# Altium schematic sheet PowerV2.SchDoc
size A3; SheetNumber: 5; SheetTotal: 6
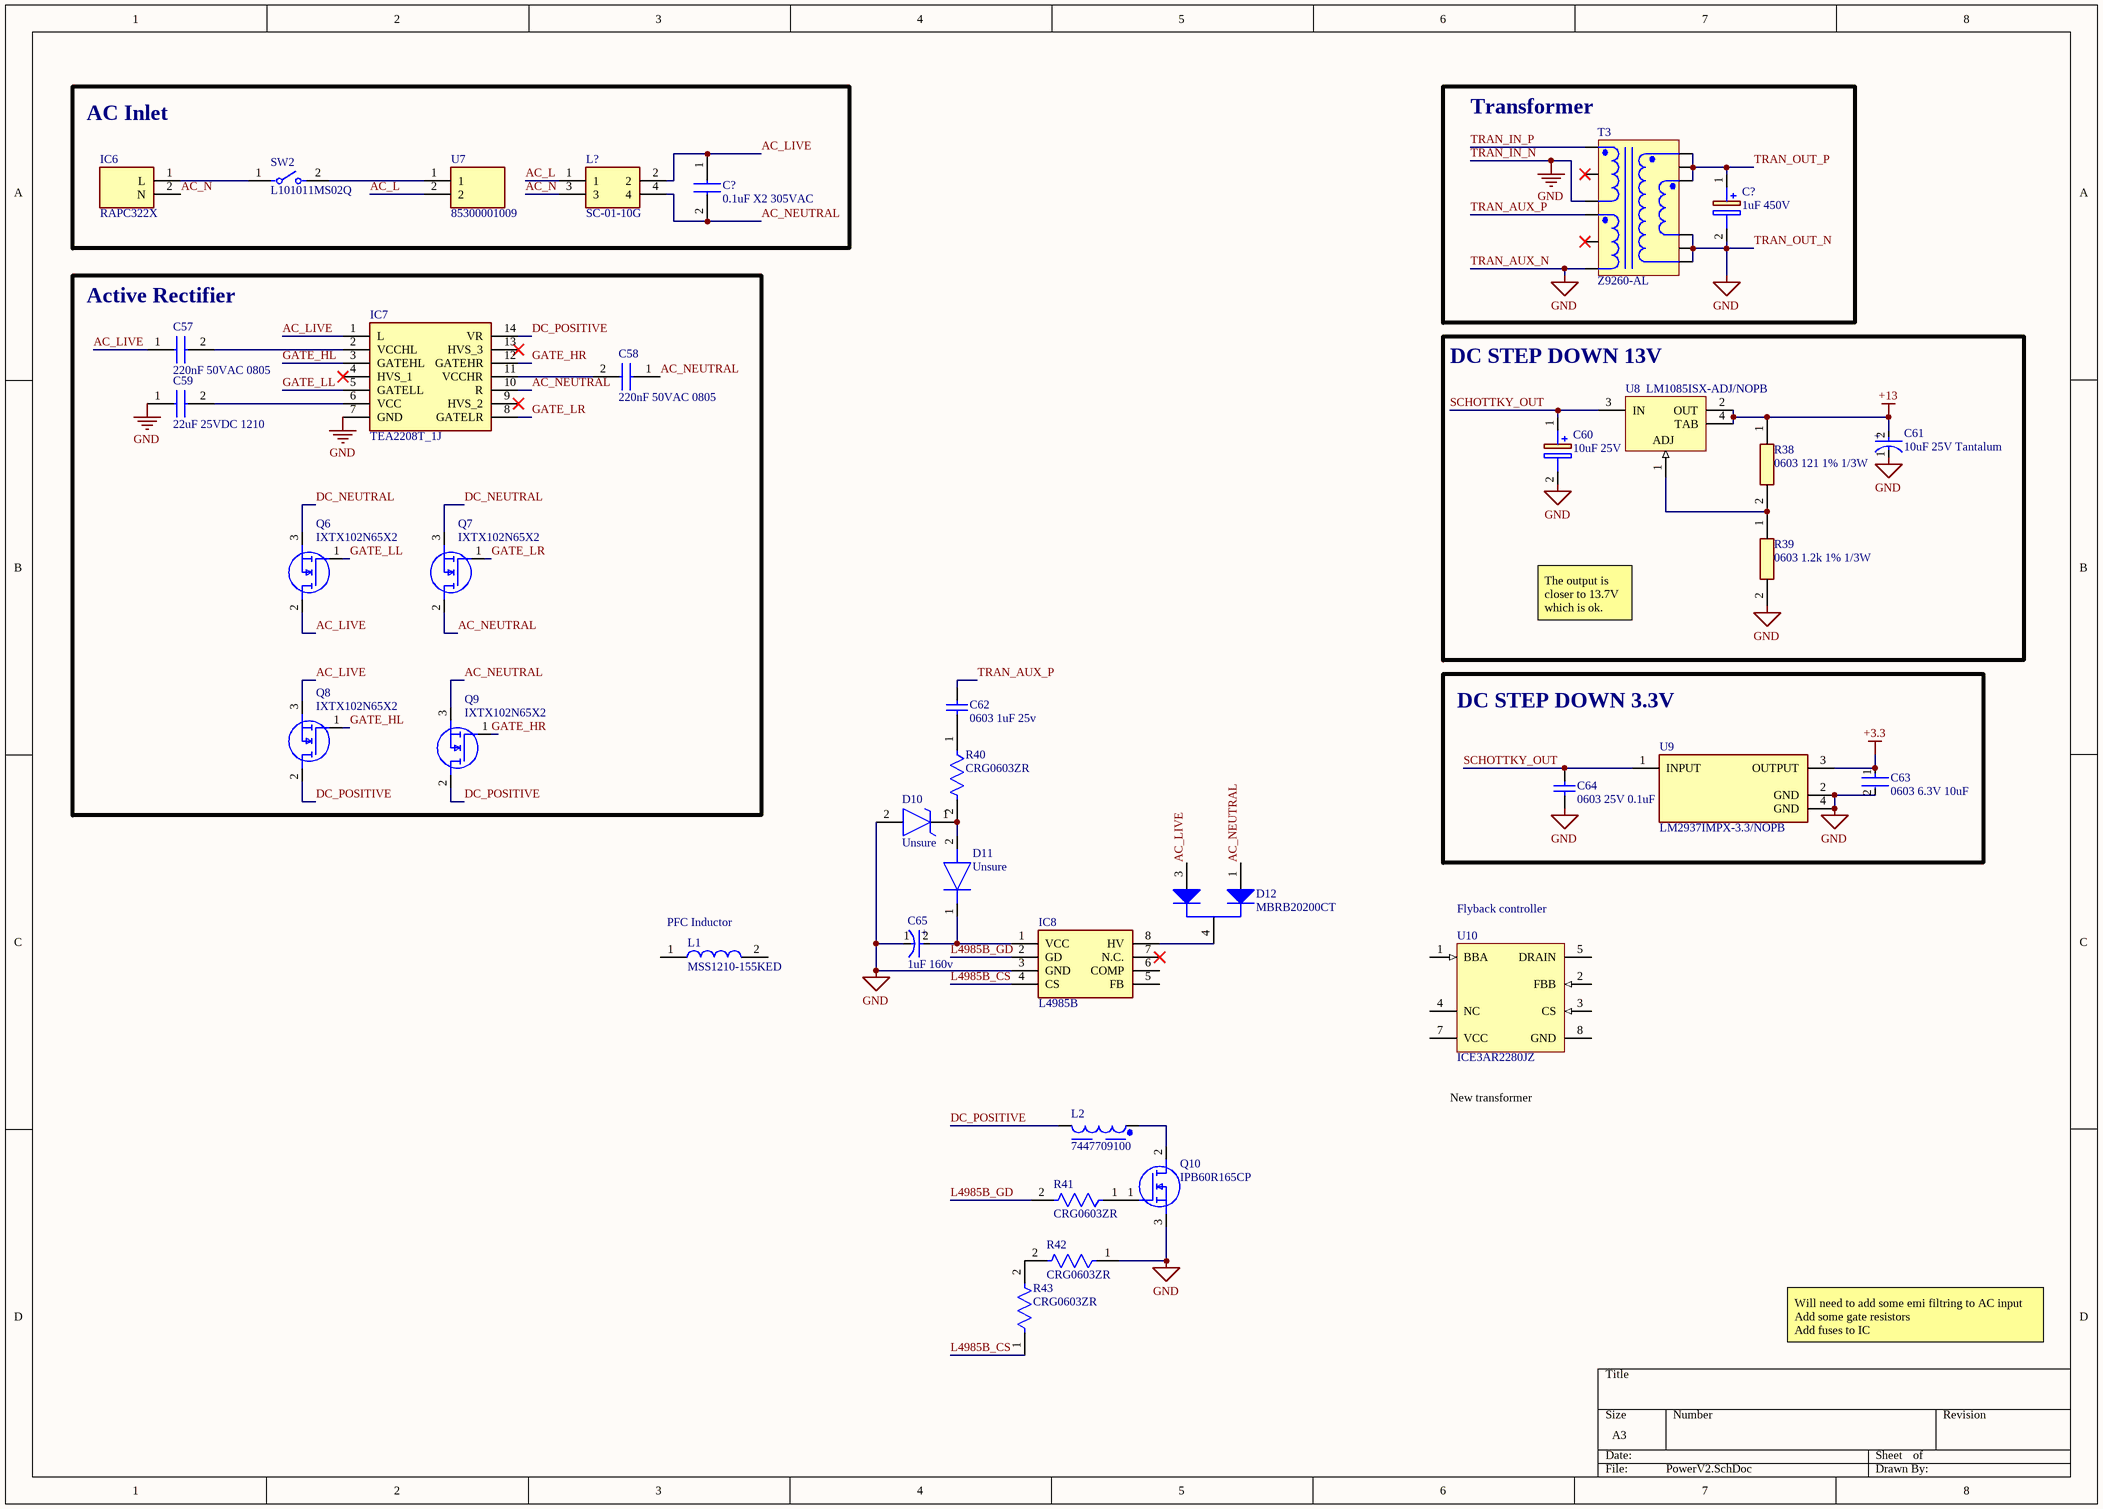
[diagram p0: PowerV2.SchDoc]

## Parts
(Parts that share a designator on the sheet are numbered #1, #2 ... from top to bottom, then left to right.)
C57  220nF 50VAC 0805  [CAPC2012X145N]
C58  220nF 50VAC 0805  [CAPC2012X145N]
C59  22uF 25VDC 1210  [CAPC3225X200N]
C60  10uF 25V  [CAPPRD200W55D500H1200]
C61  10uF 25V Tantalum  [FP-TAJB-MFG]
C62  0603 1uF 25v  [CAPC1608X87X35LL15T15]
C63  0603 6.3V 10uF  [FP-GRM188-0_1-e0_2_0_55-IPC_A]
C64  0603 25V 0.1uF  [CAPC1608X87X35LL15T15]
C65  1uF 160v  [FP-ECA-2CHG010I-MFG]
C?#1  0.1uF X2 305VAC  [B32922C_(18_x_5)]
C?#2  1uF 450V  [CAPPRD350W65D825H1250]
D10  Unsure  [DIOM5336X244N]
D11  Unsure  [DIOM5226X262N]
D12  MBRB20200CT  [ONSC-D2PAK-3-418B-04_V]
IC6  RAPC322X  [RAPC322X]
IC7  TEA2208T_1J  [SOIC127P600X175-14N]
IC8  L4985B  [SOIC127P600X175-8N]
L1  MSS1210-155KED  [MSS1210155KED]
L2  7447709100  [WE-PD_1210]
L?  SC-01-10G  [SC0110G]
Q6  IXTX102N65X2  [TO546P531X1980X2918-3P]
Q7  IXTX102N65X2  [TO546P531X1980X2918-3P]
Q8  IXTX102N65X2  [TO546P531X1980X2918-3P]
Q9  IXTX102N65X2  [TO546P531X1980X2918-3P]
Q10  IPB60R165CP  [IPB60R165CP]
R38  0603 121 1% 1/3W  [RESC1608X55N]
R39  0603 1.2k 1% 1/3W  [RESC1608X55N]
R40  CRG0603ZR  [FP-CRG0603-IPC_C]
R41  CRG0603ZR  [FP-CRG0603-IPC_C]
R42  CRG0603ZR  [FP-CRG0603-IPC_C]
R43  CRG0603ZR  [FP-CRG0603-IPC_C]
SW2  L101011MS02Q  [FP-L101011MS02Q-MFG]
T3  Z9260-AL  [COIL-Z9260-AL_Z9007-BL-12_V]
U7  85300001009  [85300001009]
U8  LM1085ISX-ADJ/NOPB  [KTT0003B_M]
U9  LM2937IMPX-3.3/NOPB  [FP-DCY0004A-IPC_A]
U10  ICE3AR2280JZ  [INF-PG-DIP-7-1_A]

## Blocks framed on the sheet
AC Inlet: C?#1 IC6 L? SW2 U7
Transformer: C?#2 T3
Active Rectifier: C57-C59 IC7 Q6-Q9
DC STEP DOWN 13V: C60 C61 R38 R39 U8
DC STEP DOWN 3.3V: C63 C64 U9

## Nets
+3.3: C63.1 U9.3(OUTPUT)
+13: C61.2(A) R38.1 U8.2(OUT) U8.4(TAB)
TRAN_AUX_N: C59.1 C60.2(-) C61.1(C) C63.2 C64.2 C65.1(C) C?#2.2(-) D10.2(A) IC7.7(GND) IC8.3(GND) Q10.3(S) R39.2 R42.1 T3.1 T3.2 T3.3 T3.7 T3.8 U9.2(GND) U9.4(GND)  [also labelled GND, TRAN_IN_N, TRAN_OUT_N]
AC_L: L?.1 U7.2
AC_LIVE: C57.1 C?#1.1 D12.3(A2) IC7.1(L) L?.2 Q6.2(D) Q8.3(S)
AC_N: IC6.2(N) L?.3
AC_NEUTRAL: C58.1 C?#1.2 D12.1(A1) IC7.10(R) L?.4 Q7.2(D) Q9.3(S)
DC_NEUTRAL: Q6.3(S) Q7.3(S)
DC_POSITIVE: IC7.14(VR) L2.2 Q8.2(D) Q9.2(D)
GATE_HL: IC7.3(GATEHL) Q8.1(G)
GATE_HR: IC7.12(GATEHR) Q9.1(G)
GATE_LL: IC7.5(GATELL) Q6.1(G)
GATE_LR: IC7.8(GATELR) Q7.1(G)
L4985B_CS: IC8.4(CS) R43.1
L4985B_GD: IC8.2(GD) R41.2
SCHOTTKY_OUT: C60.1(+) C64.1 U8.3(IN) U9.1(INPUT)
TRAN_AUX_P: C62.2 T3.11
TRAN_IN_P: T3.12
TRAN_OUT_P: C?#2.1(+) T3.4 T3.5 T3.6
NetC57_2: C57.2 IC7.2(VCCHL)
NetC58_2: C58.2 IC7.11(VCCHR)
NetC59_2: C59.2 IC7.6(VCC)
NetC62_1: C62.1 R40.1
NetC65_2: C65.2(A) D11.1(K) IC8.1(VCC)
NetD10_1: D10.1(K) D11.2(A) R40.2
NetD12_4: D12.4(K) IC8.8(HV)
NetIC6_1: IC6.1(L) SW2.1
NetL2_1: L2.1 Q10.2(D)
NetQ10_1: Q10.1(G) R41.1
NetR38_2: R38.2 R39.1 U8.1(ADJ)
NetR42_2: R42.2 R43.2
NetSW2_2: SW2.2 U7.1

Not connected (* = marked no-connect by the designer): IC7 4(HVS_1)* 9(HVS_2)* 13(HVS_3)*; IC8 5(FB) 6(COMP) 7(N.C.)*; L1 1 2; T3 9* 10*; U10 1(BBA) 2(FBB) 3(CS) 4(NC) 5(DRAIN) 7(VCC) 8(GND)

## Notes on the sheet
- The output is closer to 13.7V which is ok.
- (near U10) Flyback controller
- (near L1) PFC Inductor
- (near U10) New transformer
- Will need to add some emi filtring to AC input
  Add some gate resistors
  Add fuses to IC
- (in symbol CMP-04424-000481-1) +
- (in symbol CMP-05427-002176-1) +

## Library data of the parts
C57 C58 = AC0805KFX7R9BB224: Capacitor; Manufacturer_Name: KEMET; Datasheet Link: http://www.yageo.com/documents/recent/UPY-AC_NP0X7R_16V-to-630V_12.pdf; Height: 1.45mm; Manufacturer_Part_Number: AC0805KFX7R9BB224
C59 = 25MU225MB23225: Capacitor; Manufacturer_Name: Rubycon; Datasheet Link: http://www.rubycon.co.jp/en/catalog/e_pdfs/pmlcap/e_MU.pdf; Height: 2mm; Manufacturer_Part_Number: 25MU225MB23225; Mouser Part Number: 232-25MU225MB23225; Mouser Price/Stock: https://www.mouser.co.uk/ProductDetail/Rubycon/25MU225MB23225?qs=T3oQrply3y80th0zXFlwOw%3D%3D
C60 = ECA-1EM100: Capacitor Polarised; Manufacturer_Name: Panasonic; Datasheet Link: https://componentsearchengine.com/Datasheets/2/ECA-1EM100.pdf; Height: 12mm; Manufacturer_Part_Number: ECA-1EM100; Mouser Part Number: 667-ECA-1EM100; Mouser Price/Stock: https://www.mouser.com/Search/Refine.aspx?Keyword=667-ECA-1EM100; Arrow Part Number: ECA-1EM100; Arrow Price/Stock: https://www.arrow.com/en/products/eca1em100/panasonic
C61 = CMP-04424-000481-1: 10uF 25V  ±10% 2.5Ω 1210  SMD Tantalum Capacitor; ESR (Equivalent Series Resistance): 2.5R; Polarity: Polar; Dissipation Factor: 6%; Leakage Current: 2.5uA; Lead Free: Lead Free; Capacitance: 10uF; Voltage Rating: 25V; Mount: Surface Mount; Packaging: Tape and Reel; Min Operating Temperature: -55°C; Weight: 0.000564oz; Series: TAJ; Case/Package: 1210; Width: 0.11inch; Height - Seated (Max): 0.083inch; RoHS Compliant: Yes; Height: 2.1mm; Depth: 2.8mm; Radiation Hardening: No; Construction: Flat; Max Operating Temperature: 125°C; Voltage Rating (DC): 25V; Features: General Purpose; REACH SVHC: No SVHC; Tolerance: 10%; Package Quantity: 1; Case Code (Metric): 3528; Termination: SMD/SMT; Case Code (Imperial): 1210; Length: 3.5mm
C62 C64 = CMP-2006-03713-1: Part Number: C0603C105K3RACTU; Manufacturer: Kemet
C63 = CMP-2006-02792-2: Chip Multilayer Ceramic Capacitors for General Purpose, 0603, 10uF, X5R, 15%, 20%, 6.3V; Packaging: Tape and Reel; Voltage Rating (DC): 6.3V; Width: 0.031inch; Termination: SMD/SMT; Dielectric: X5R; Package Quantity: 4000; Voltage Rating: 6.3V; Capacitance: 10uF; Case/Package: 0603; Min Operating Temperature: -55°C; Voltage: 6.3V; Length: 1.6mm; Thickness: 0.035inch; Lead Free: Lead Free; Depth: 0.8mm; Case Code (Imperial): 0603; Max Operating Temperature: 85°C; Material: Ceramic; Height: 0.8mm; Tolerance: 20%; Mount: Surface Mount; REACH SVHC: No SVHC; Radiation Hardening: No; Case Code (Metric): 1608
C65 = CMP-05427-002176-1: CAP ALUM 1UF 20% 160V RADIAL; Lead/Base Style: Straight; Ripple Current: 17mA; Life (Hours): 2000Hour; Voltage Rating (DC): 160V; Max Operating Temperature: 105°C; Radiation Hardening: No; Min Operating Temperature: -25°C; Packaging: Ammo Pack; Series: NHG; Capacitance: 1uF; Height - Seated (Max): 0.48inch; Lead Pitch: 2.5mm; Diameter: 6.3mm; Length: 11.2mm; Package Quantity: 2000; Termination: Radial; RoHS Compliant: Yes; Voltage Rating: 160V; Tolerance: 20%; Height: 11.2mm; Case/Package: Radial; Mount: Through Hole
C?#1 = B32922C3104K289: Capacitor; Manufacturer_Name: TDK; Datasheet Link: https://product.tdk.com/system/files/dam/doc/product/capacitor/film/emi/data_sheet/20/20/db/fc_2009/x2_b32921_928.pdf; Manufacturer_Part_Number: B32922C3104K289; Mouser Part Number: 871-B32922C3104K289; Mouser Price/Stock: https://www.mouser.co.uk/ProductDetail/EPCOS-TDK/B32922C3104K289?qs=w5o0Loj0u7OxRKa1IZTr8g%3D%3D; Arrow Part Number: B32922C3104K289; Arrow Price/Stock: https://www.arrow.com/en/products/b32922c3104k289/tdk?utm_currency=USD&region=nac
C?#2 = ECA-2WM010: Capacitor Polarised; Manufacturer_Name: Panasonic; Datasheet Link: http://www.mouser.com/ds/2/315/ABA0000C1047-947484.pdf; Height: 12.5mm; Manufacturer_Part_Number: ECA-2WM010; Mouser Part Number: 667-ECA-2WM010; Mouser Price/Stock: https://www.mouser.com/Search/Refine.aspx?Keyword=667-ECA-2WM010
D10 = SMBJ170A: TVS Diode (Uni-directional); Manufacturer_Name: HY Electronic; Height: 2.44mm; Manufacturer_Part_Number: SMBJ170A
D11 = CMR1U-06M_TR13_PBFREE: Diode; Manufacturer_Name: Central Semiconductor; Manufacturer_Part_Number: CMR1U-06M TR13 PBFREE; Datasheet Link: https://my.centralsemi.com/datasheets/CMR1U01M.PDF; Height: 2.62mm; Mouser Part Number: 610-CMR1U-06M; Mouser Price/Stock: https://www.mouser.co.uk/ProductDetail/Central-Semiconductor/CMR1U-06M-TR13-PBFREE/?qs=u16ybLDytRaiTbcu0RAPhw%3D%3D
D12 = CMP-1055-00130-1: SWITCHMODE(TM) Power Rectifier, Dual Schottky Rectifiers, 3-Pin D2PAK, Tube; Manufacturer: On Semiconductor; Note1: 0; IFSM Max (A): 150; Configuration: Common Cathode; ComponentLink2Description: Datasheet; ComponentLink3Description: Package Specification; ComponentLink3URL: http://www.onsemi.com/pub_link/Collateral/418B-04.PDF; ComponentLink1URL: http://www.onsemi.com/; PackageReference: D2PAK-3-418B-04; ComponentLink2URL: http://www.onsemi.cn/pub_link/Collateral/MBRB20200CT-D.PDF; DatasheetVersion: Rev. 7; Mounting Technology: Surface Mount; Packing: Tube; PackageVersion: Rev. K, 09/2008; PackageDescription: 3-Pin Flange Mount, Body 9.145 x 9.97 mm, Pitch 2.54 mm; ComponentLink1Description: Manufacturer URL; PartNumber: MBRB20200CT; RoHS: FALSE
IC6 = RAPC322X: Integrated Circuit; Manufacturer_Name: Switchcraft; Datasheet Link: http://www.switchcraft.com/Drawings/RAPC322X_CD.PDF; Height: 13mm; Manufacturer_Part_Number: RAPC322X; Mouser Part Number: 502-RAPC322X; Mouser Price/Stock: https://www.mouser.co.uk/ProductDetail/Switchcraft/RAPC322X?qs=mcPJWgAPNrcmmHrLtKpxWA%3D%3D; Arrow Part Number: RAPC322X; Arrow Price/Stock: https://www.arrow.com/en/products/rapc322x/switchcraft?region=nac
IC7 = TEA2208T_1J: Integrated Circuit; Manufacturer_Name: NXP; Manufacturer_Part_Number: TEA2208T/1J; Datasheet Link: https://www.nxp.com/docs/en/data-sheet/TEA2208T.pdf; Height: 1.75mm; Mouser Part Number: 771-TEA2208T/1J; Mouser Price/Stock: https://www.mouser.co.uk/ProductDetail/NXP-Semiconductors/TEA2208T-1J?qs=wnTfsH77Xs7i9IS7OBVq2w%3D%3D
IC8 = L4985B: Integrated Circuit; Manufacturer_Name: STMicroelectronics; Datasheet Link: https://www.st.com/resource/en/datasheet/l4985.pdf; Height: 1.75mm; Manufacturer_Part_Number: L4985B; Mouser Part Number: 511-L4985B; Mouser Price/Stock: https://www.mouser.co.uk/ProductDetail/STMicroelectronics/L4985B?qs=TCDPyi3sCW2vu0U49h065A%3D%3D
L1 = MSS1210-155KED: Inductor; Manufacturer_Name: COILCRAFT; Datasheet Link: https://www.coilcraft.com/getmedia/f1a1bc5f-bdff-42f8-9ca8-1a0fb1d5094f/MSS1210.pdf; Height: 10.2mm; Manufacturer_Part_Number: MSS1210-155KED; Mouser Part Number: 994-MSS1210-155KED; Mouser Price/Stock: https://www.mouser.co.uk/ProductDetail/Coilcraft/MSS1210-155KED?qs=zCSbvcPd3pYRwhcmlJV9xg%3D%3D
L2 = CMP-0227-00034-2: NexarPartId: 21642419; Core Material: Ferrite; DC Resistance (DCR): 13mΩ; Test Frequency: 1kHz; Max DC Current: 7.1A; Series Resistance: 21mΩ; Inductance: 10µH; Tolerance: 20%; Saturation Current: 10.5A; Self Resonant Frequency: 21MHz; Shielding: Shielded; Ambient Temperature Range Low: -40°C; Number of Pins: 2; Height - Seated (Max): 10.0076mm; Length: 12mm; Max Operating Temperature: 125°C; Width: 12mm; Case Code (Metric): 3225; Composition: Wirewound; REACH SVHC: Unknown; Case/Package: Nonstandard; Packaging: Tape & Reel (TR); RoHS: Compliant; Current Rating: 7.1A; Min Operating Temperature: -40°C; Resistance: 21mΩ; Inductance Tolerance: 20%; Lead Pitch: 7mm; Case Code (Imperial): 1210; Height: 10mm; Ambient Temperature Range High: 85°C; Mount: Surface Mount; Weight: 4.535924g; Lead Free: Lead Free; Depth: 12mm; Termination: SMD/SMT; RMS Current (Irms): 7.1A
L? = SC-01-10G: Inductor; Manufacturer_Name: KEMET; Datasheet Link: https://content.kemet.com/datasheets/KEM_LF0011_SC-G-GS.pdf; Height: 23mm; Manufacturer_Part_Number: SC-01-10G; Mouser Part Number: 80-SC-01-10G; Mouser Price/Stock: https://www.mouser.co.uk/ProductDetail/KEMET/SC-01-10G?qs=BenOyfdfArpzDVRBtNEKMw%3D%3D
Q6-Q9 = IXTX102N65X2: MOSFET (N-Channel); Manufacturer_Name: LITTELFUSE; Datasheet Link: http://ixapps.ixys.com/DataSheet/DS100655B(IXTK-TX102N65X2).pdf; Height: 5.31mm; Manufacturer_Part_Number: IXTX102N65X2; Mouser Part Number: 747-IXTX102N65X2; Mouser Price/Stock: https://www.mouser.com/Search/Refine.aspx?Keyword=747-IXTX102N65X2
Q10 = IPB60R165CP: MOSFET (N-Channel); Manufacturer_Name: Infineon; Datasheet Link: https://www.infineon.com/dgdl/Infineon-IPB60R165CP-DS-v02_01-en.pdf?fileId=db3a304412b407950112b42dd38f48fc; Height: 4.826mm; Manufacturer_Part_Number: IPB60R165CP; Mouser Part Number: 726-IPB60R165CP; Mouser Price/Stock: https://www.mouser.co.uk/ProductDetail/Infineon-Technologies/IPB60R165CP?qs=mzcOS1kGbgdcrfUvmAosLQ%3D%3D
R38 = CRCW0603121RFKEAHP: Resistor; Manufacturer_Name: Vishay; Datasheet Link: https://www.vishay.com/docs/20043/crcwhpe3.pdf; Height: 0.55mm; Manufacturer_Part_Number: CRCW0603121RFKEAHP; Mouser Part Number: 71-CRCW0603121RFKEAH; Mouser Price/Stock: https://www.mouser.co.uk/ProductDetail/Vishay-Dale/CRCW0603121RFKEAHP?qs=40TFAHZMFvf7JpHs6aBGEg%3D%3D; Arrow Part Number: CRCW0603121RFKEAHP; Arrow Price/Stock: https://www.arrow.com/en/products/crcw0603121rfkeahp/vishay?region=nac
R39 = CRCW06031K20FKEAHP: Resistor; Manufacturer_Name: Vishay; Datasheet Link: https://www.vishay.com/docs/20043/crcwhpe3.pdf; Height: 0.55mm; Manufacturer_Part_Number: CRCW06031K20FKEAHP; Mouser Part Number: 71-CRCW06031K20FKEAH; Mouser Price/Stock: https://www.mouser.co.uk/ProductDetail/Vishay-Dale/CRCW06031K20FKEAHP?qs=40TFAHZMFveP9B2Fb67Ndg%3D%3D; Arrow Part Number: CRCW06031K20FKEAHP; Arrow Price/Stock: https://www.arrow.com/en/products/crcw06031k20fkeahp/vishay?region=nac
R40-R43 = CMP-03211-011415-1: RES SMD 0 OHM JUMPER 1/10W 0603; Voltage Rating: 50V; Resistance: 0mR; Power Rating: 100mW; Number of Resistors: 1; Tolerance: 0%; Temperature Coefficient: 100ppm/°C; Packaging: Tape and Reel; Series: CRG, Neohm; Technology: THICK FILM; Depth: 0.8mm; Width: 0.8mm; Min Operating Temperature: -55°C; Number of Terminations: 2; Length: 1.6mm; Weight: 7.1E-05oz; Resistor Type: Thick Film; Height: 0.45mm; Max Operating Temperature: 125°C; Case/Package: 0603; ELV: Compliant; Package Quantity: 5000; Radiation Hardening: No; RoHS Compliant: Yes; Termination: Solder; Case Code (Metric): 1608; Mount: Surface Mount; Case Code (Imperial): 0603; Max Power Dissipation: 100mW
SW2 = CMP-10038-000020-1: SWITCH SLIDE SPST 4A 125V; Actuator Length: 5.08mm; Actuator Type: Standard; Contact Current Rating: 2A; Electrical Life: 10000Cycles; Switch Function: On-Off; Voltage Rating (DC): 28V; Actuator Color: Black; Actuator Material: Nylon; Switch Travel: 3.81mm; Max Voltage Rating (AC): 250V; Max Current Rating: 4A; Contact Plating: Silver; Throw Configuration: SPST; Depth: 10.8mm; Package Quantity: 1; Length: 19.1mm; Current Rating: 4A; Max Operating Temperature: 65°C; Orientation: Straight; Radiation Hardening: No; Termination: PC Pins; Max Voltage Rating (DC): 125V; Series: L; Min Operating Temperature: -30°C; Contact Material: Copper; Lead Free: Lead Free; Mount: Through Hole; RoHS Compliant: Yes; Voltage Rating (AC): 125V; Packaging: Bulk; Housing Material: Nylon
T3 = CMP-0536-00004-2: Flyback Transformer, 70 W, -40 to 85 degC, 36.8 x 36.8 x 29.7 mm Package; Manufacturer: Coilcraft; Output: 16 V, 4.2 A(sec) 15 V, 0.2 A (aux); DCR max (Ohms): 0.261 (12-7) 0.013 (6-1) 0.013 (4-3) 0.045 (11-8); Leakage inductance max (uH): 26; Isolation (Vrms): 2000; Inductance +/-10% (mH): 0.7; PartNumber: Z9260-AL; ComponentLink1URL: http://www.coilcraft.com/; DatasheetVersion: 31/01/2005; Mounting Technology: Through Hole; ComponentLink2URL: http://www.coilcraft.com/pdf_viewer/showpdf.cfm?f=pdf_store:y8844.pdf; ComponentLink3URL: http://www.coilcraft.com/pdf_viewer/showpdf.cfm?f=pdf_store:y8844.pdf; ComponentLink2Description: Datasheet; Application: 70 W; PackageReference: Z9260-AL-12; Operating Temperature Range: -40 to 85 degC; PackageDescription: 12-Pin Through Hole Package, Body 36.8 x 36.8 mm; ComponentLink3Description: Package Specification; ComponentLink1Description: Manufacturer URL
U7 = 85300001009: Undefined or Miscellaneous; Manufacturer_Name: LITTELFUSE; Datasheet Link: https://www.digikey.ph/en/products/detail/littelfuse-inc/85300001009/653461; Height: 32.9mm; Manufacturer_Part_Number: 85300001009; Mouser Part Number: 576-85300001009; Mouser Price/Stock: https://www.mouser.co.uk/ProductDetail/Littelfuse/85300001009?qs=ImUY93axo1htCnreTZ0QOw%3D%3D; Arrow Part Number: 85300001009; Arrow Price/Stock: https://www.arrow.com/en/products/85300001009/littelfuse
U8 = CMP-0062-00598-5: 3A Low Dropout Positive Regulators, 3-pin TO-263, Pb-Free; Manufacturer: Texas Instruments; PackageTopMarking: NSUZXYTTE#*LM1085*IS-ADJ; CompType: LDO IC; PowerWise: N; High-Reliability: Y; Code_JEDEC: MO-169-AA; PackageDescription: TO-263, Molded, .400 x .390 x .180in, 3 Lead, .1in Pitch, Surface Mount; ComponentLink1Description: Datasheet URL; PinCount: 3; PackageReference: KTT0003B; ComponentLink1URL: http://www.ti.com/general/docs/lit/getliterature.tsp?genericPartNumber=LM1085&fileType=pdf; PartNumber: LM1085ISX-ADJ/NOPB; RoHS: Y
U9 = CMP-04917-000345-1: IC REG LIN 3.3V 400MA SOT223-4; Number of Regulators: 1; Output Voltage Accuracy: 5%; Output Type: Fixed; Max Input Voltage: 26V; Polarity: Positive; Min Input Voltage: 4.75V; Dropout Voltage: 500mV; Quiescent Current: 10mA; Package Quantity: 2000; Output Voltage: 3.3V; Max Operating Temperature: 125°C; Accuracy: 5%; Radiation Hardening: No; RoHS Compliant: Yes; Packaging: Tape and Reel; Number of Pins: 4; Output Current: 400mA; Max Output Current: 400mA; Number of Outputs: 1; Min Operating Temperature: -40°C; Mount: Surface Mount; Case/Package: TO-261-4; Lead Free: Lead Free
U10 = CMP-1102-00009-1: Off-Line SMPS Current Mode Controller with Integrated 800 V CoolMOS and Startup Cell (Brownout & Frequency Jitter), 10.5 to 25 V, -25 to 130 degC, PG-DIP-7-1, Tube, Green; Manufacturer: Infineon; Green: TRUE; Green Product: Lead Free; tf (typ): 30Â ns; RDS (on) (typ): 2.26Â Ohm; ESD Protection (max): 2Â kV; Frequency ( f ) Range: 100 kHz (fixed); RthJA (max): 96Â K/W; VCC (max): 25Â V; VCC (min): 10.5Â V; ICC (typ): 3.4Â mA; VDS (max): 800Â V; ID (max): 1.5Â A; PIN (max): 28Â W; DatasheetVersion: Rev. 2.1a; ComponentLink3URL: http://www.infineon.com/dgdl/Datasheet_ICE3BR0680JZ_V21a_11Jan2012.pdf?folderId=db3a30431f848401011fcbf221ff04c3&fileId=db3a304329a0f6ee0129e8b5bf735b64; ComponentLink3Description: Package Specification; PartNumber: ICE3AR2280JZ; ComponentLink2Description: Datasheet; PackageReference: PG-DIP-7-1; tr (typ): 30Â ns; PackageDescription: 7-Pin Plastic (Green) Dual In-Line Package, 9.44 x 6.35 mm Body, 2.54 mm Pitch; Mounting Technology: Through Hole; ComponentLink1URL: http://www.infineon.com/; ComponentLink2URL: http://www.infineon.com/dgdl/Datasheet_ICE3AR2280JZ_V21a_11Jan2012.pdf?folderId=db3a304412b407950112b4182a3d24f8&fileId=db3a3043284aacd801288a42141f2ad1; PackageVersion: Rev. 02, 07/2011; ComponentLink1Description: Manufacturer URL